# EAGLE schematic pcf8574 (EAGLE 6.4)
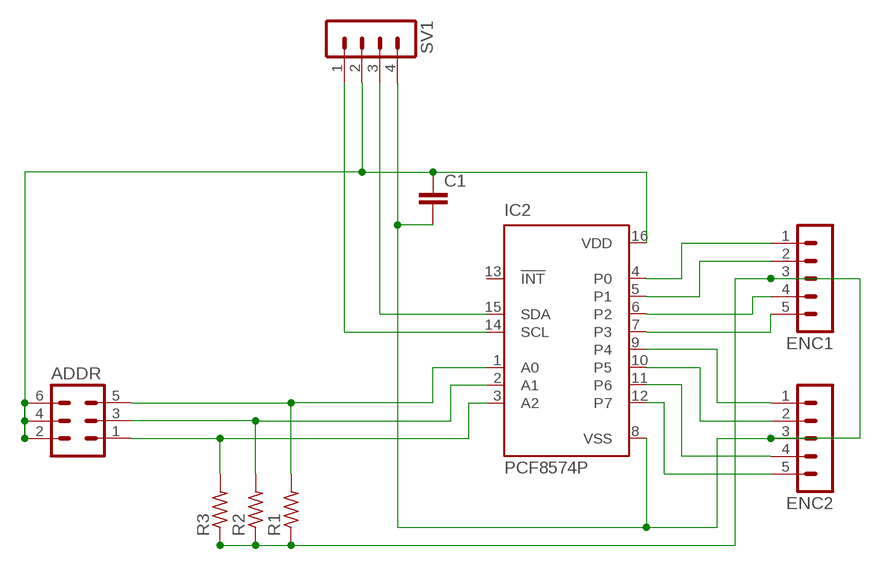
[diagram p0: schematic, sheet 1]

## Parts
ADDR  MA03-2  [MA03-2]
C1  C5/2.5  [C5B2.5]
ENC1  MA05-1  [MA05-1]
ENC2  MA05-1  [MA05-1]
IC2  PCF8574P  [DIL16]
R1  R-US_0204/7  [0204/7]
R2  R-US_0204/7  [0204/7]
R3  R-US_0204/7  [0204/7]
SV1  MA04-1  [MA04-1]

## Nets
N$1: IC2.14(SCL) SV1.1
N$2: ADDR.2 ADDR.4 ADDR.6 C1.1 IC2.16(VDD) SV1.2
N$3: ENC2.5 IC2.12(P7)
N$4: ADDR.5 IC2.1(A0) R1.2
N$5: ADDR.3 IC2.2(A1) R2.2
N$6: ADDR.1 IC2.3(A2) R3.2
N$7: IC2.15(SDA) SV1.3
N$8: ENC2.4 IC2.11(P6)
N$10: ENC2.2 IC2.10(P5)
N$11: ENC2.1 IC2.9(P4)
N$12: ENC1.4 IC2.6(P2)
N$13: ENC1.2 IC2.5(P1)
N$14: ENC1.1 IC2.4(P0)
N$15: ENC1.5 IC2.7(P3)
N$17: C1.2 ENC1.3 ENC2.3 IC2.8(VSS) R1.1 R2.1 R3.1 SV1.4
Unconnected: IC2.13(!INT)

## Library data of the parts
ADDR = con-lstb:MA03-2: PIN HEADER; OC_FARNELL: unknown; OC_NEWARK: unknown
C1 = capacitor-wima:C: CAPACITOR naming: grid - package width
ENC1 ENC2 = con-lstb:MA05-1: PIN HEADER; OC_FARNELL: unknown; OC_NEWARK: unknown
IC2 = micro-philips:PCF8574: I2C-Bus Remote 8-bit I/O expander http://www.semiconductors.philips.com/acrobat_download/datasheets/PCF8574_4.pdf; MPN: PCF8574PN; OC_FARNELL: 204020; OC_NEWARK: 11N8515
R1-R3 = resistor:R-US_: RESISTOR, American symbol
SV1 = con-lstb:MA04-1: PIN HEADER; OC_FARNELL: unknown; OC_NEWARK: unknown